# Altium schematic sheet ESP32-S3.SchDoc
size A3
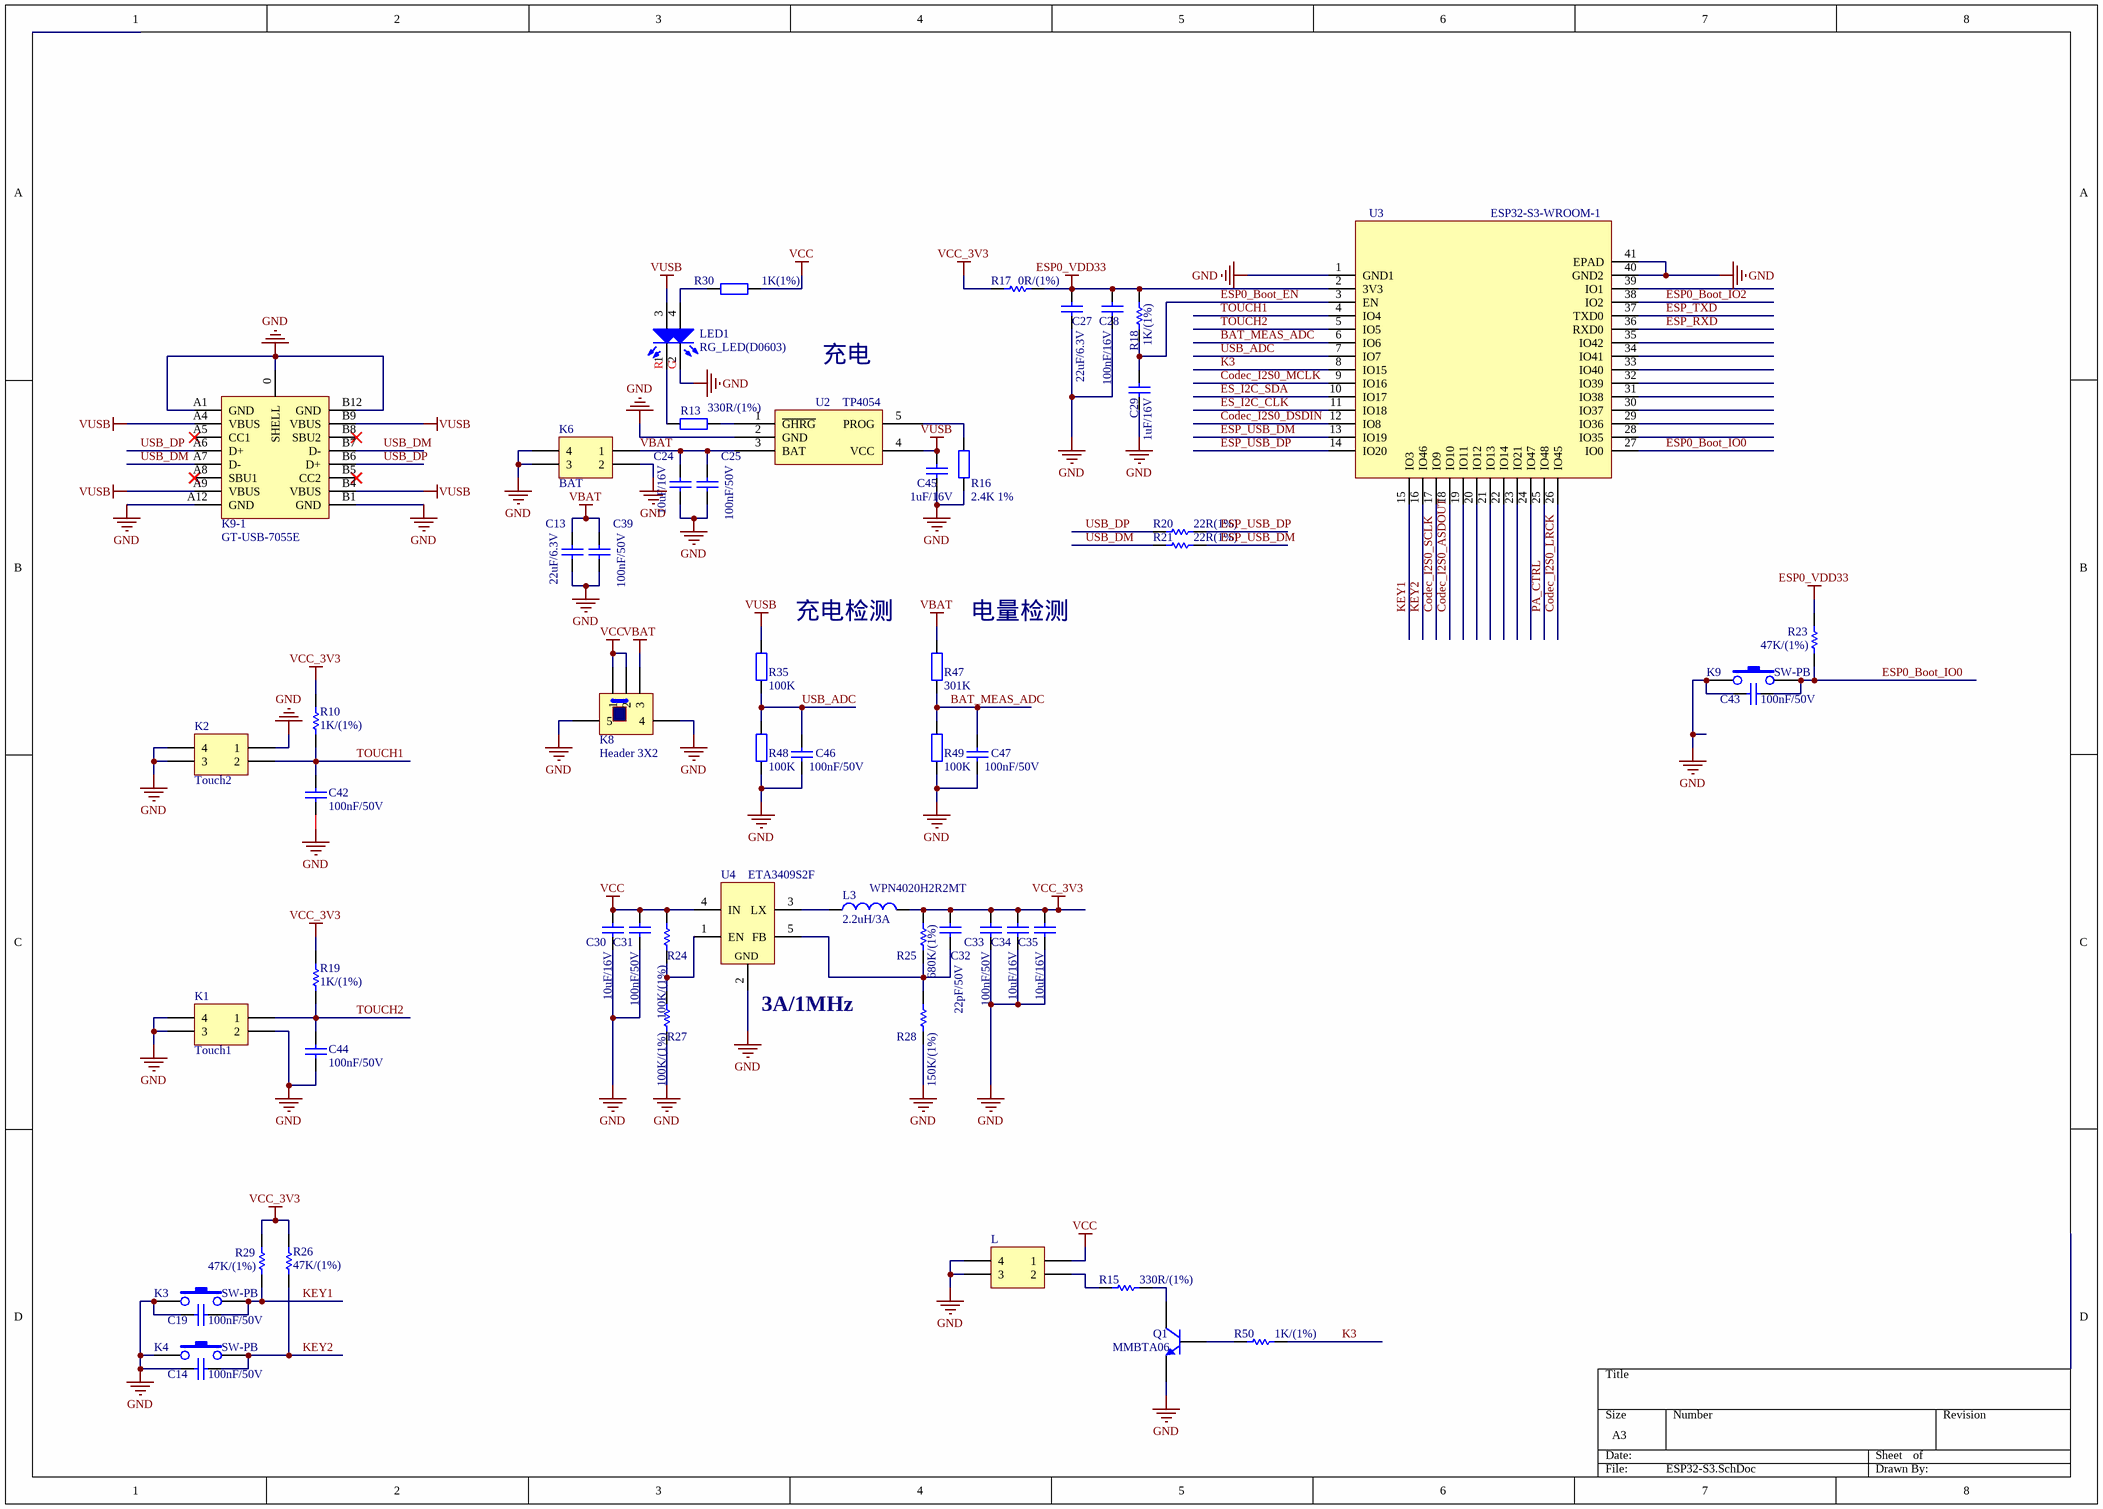
[diagram p0: ESP32-S3.SchDoc]

## Parts
C13  22uF/6.3V  [C0402]
C14  100nF/50V  [C0402]
C19  100nF/50V  [C0402]
C24  10uF/16V  [C0402]
C25  100nF/50V  [C0402]
C27  22uF/6.3V  [C0402]
C28  100nF/16V  [C0402]
C29  1uF/16V  [C0402]
C30  10uF/16V  [C0402]
C31  100nF/50V  [C0402]
C32  22pF/50V  [C0402]
C33  100nF/50V  [C0402]
C34  10uF/16V  [C0402]
C35  10uF/16V  [C0402]
C39  100nF/50V  [C0402]
C42  100nF/50V  [C0402]
C43  100nF/50V  [C0402]
C44  100nF/50V  [C0402]
C45  1uF/16V  [C0402]
C46  100nF/50V  [C0402]
C47  100nF/50V  [C0402]
K1  Touch1  [HC-1.25-2PWT]
K2  Touch2  [HC-1.25-2PWT]
K3  SW-PB  [K(3*4*2.5H)]
K4  SW-PB  [K(3*4*2.5H)]
K6  BAT  [HC-1.25-2PWT]
K8  Header 3X2  [SS12D07VG4 087]
K9  SW-PB  [K(3*4*2.5H)]
K9-1  GT-USB-7055E  [GT-USB-7055E]
L  (no value)  [HC-1.25-2PWT]
L3  2.2uH/3A  [SWPA4020]
LED1  RG_LED(D0603)  [LED-SMD_4P-L1.6]
Q1  MMBTA06  [SOT-23]
R10  1K/(1%)  [R0402]
R13  330R/(1%)  [R0402]
R15  330R/(1%)  [R0402]
R16  2.4K 1%  [R0402]
R17  0R/(1%)  [R0402]
R18  1K/(1%)  [R0402]
R19  1K/(1%)  [R0402]
R20  22R(1%)  [R0402]
R21  22R(1%)  [R0402]
R23  47K/(1%)  [R0402]
R24  100K/(1%)  [R0402]
R25  680K/(1%)  [R0402]
R26  47K/(1%)  [R0402]
R27  100K/(1%)  [R0402]
R28  150K/(1%)  [R0402]
R29  47K/(1%)  [R0402]
R30  1K(1%)  [R0402]
R35  100K  [R0402]
R47  301K  [R0402]
R48  100K  [R0402]
R49  100K  [R0402]
R50  1K/(1%)  [R0402]
U2  TP4054  [SOT-23-5]
U3  ESP32-S3-WROOM-1  [ESP32-S3-WROOM-1]
U4  ETA3409S2F  [SOT23-5_ETA3409S2F]

## Nets
ESP0_VDD33: C27.2 C28.2 R17.2 R18.1 R23.1 U3.2(3V3)
GND: C13.1 C14.2 C19.2 C24.1 C25.1 C27.1 C28.1 C29.1 C30.1 C31.1 C33.1 C34.1 C35.1 C39.1 C42.2 C43.2 C44.2 C45.2 C46.2 C47.2 K1.2 K1.3 K1.4 K2.1 K2.3 K2.4 K3.1 K4.2 K6.2 K6.3 K6.4 K8.4 K8.5 K9.1 K9-1.0(SHELL) K9-1.A1(GND) K9-1.A12(GND) K9-1.B1(GND) K9-1.B12(GND) L.3 L.4 LED1.2 Q1.2(E) R16.1 R27.2 R28.2 R48.1 R49.1 U2.2(GND) U3.1(GND1) U3.40(GND2) U3.41(EPAD) U4.2(GND)
VBAT: C13.2 C24.2 C25.2 C39.2 K6.1 K8.3 R47.2 U2.3(BAT)
VCC: C30.2 C31.2 K8.1 K8.2 L.1 R24.1 R30.2 U4.4(IN)
VCC_3V3: C32.2 C33.2 C34.2 C35.2 L3.2 R10.1 R17.1 R19.1 R25.1 R26.1 R29.1
VUSB: C45.1 K9-1.A4(VBUS) K9-1.A9(VBUS) K9-1.B4(VBUS) K9-1.B9(VBUS) LED1.3 R35.2 U2.4(VCC)
BAT_MEAS_ADC: C47.1 R47.1 R49.2 U3.6(IO6)
Codec_I2S0_ASDOUT: U3.18(IO10)
Codec_I2S0_DSDIN: U3.12(IO8)
Codec_I2S0_LRCK: U3.26(IO45)
Codec_I2S0_MCLK: U3.9(IO16)
Codec_I2S0_SCLK: U3.17(IO9)
ES_I2C_CLK: U3.11(IO18)
ES_I2C_SDA: U3.10(IO17)
ESP0_Boot_EN: C29.2 R18.2 U3.3(EN)
ESP0_Boot_IO0: C43.1 K9.2 R23.2 U3.27(IO0)
ESP0_Boot_IO2: U3.38(IO2)
ESP_RXD: U3.36(RXD0)
ESP_TXD: U3.37(TXD0)
ESP_USB_DM: R21.1 U3.13(IO19)
ESP_USB_DP: R20.1 U3.14(IO20)
K3: R50.1 U3.8(IO15)
KEY1: C19.1 K3.2 R29.2 U3.15(IO3)
KEY2: C14.1 K4.1 R26.2 U3.16(IO46)
PA_CTRL: U3.25(IO48)
TOUCH1: C42.1 K2.2 R10.2 U3.4(IO4)
TOUCH2: C44.1 K1.1 R19.2 U3.5(IO5)
USB_ADC: C46.1 R35.1 R48.2 U3.7(IO7)
USB_DM: K9-1.A7(D-) K9-1.B7(D-) R21.2
USB_DP: K9-1.A6(D+) K9-1.B6(D+) R20.2
NetC32_1: C32.1 R25.2 R28.1 U4.5(FB)
NetL3_1: L3.1 U4.3(LX)
NetL_2: L.2 R15.2
NetLED1_1: LED1.1 R13.1
NetLED1_4: LED1.4 R30.1
NetQ1_1: Q1.1(B) R50.2
NetQ1_3: Q1.3(C) R15.1
NetR13_2: R13.2 U2.1(~{GHRG})
NetR16_2: R16.2 U2.5(PROG)
NetR24_2: R24.2 R27.1 U4.1(EN)

Not connected (* = marked no-connect by the designer): K9-1 A5(CC1)* A8(SBU1)* B5(CC2)* B8(SBU2)*; U3 19(IO11) 20(IO12) 21(IO13) 22(IO14) 23(IO21) 24(IO47) 28(IO35) 29(IO36) 30(IO37) 31(IO38) 32(IO39) 33(IO40) 34(IO41) 35(IO42) 39(IO1)

## Notes on the sheet
- 充电
- (near R35) 充电检测
- (near R47) 电量检测
- (near L3) WPN4020H2R2MT
- (near U4) 3A/1MHz
- (in symbol RG_LED) R; G

## Library data of the parts
C13 C24 = 0603 10uF (106) 10% 10V: 贴片电容; ComponentLink1Description: *; ComponentLink1URL: *; Package: *; Supplier: *; SuppliersPartNumber: *
C14 C19 C27-C35 C42-C44 = Cap: Capacitor; Value: 100pF; Published: 8-Jun-2000; LatestRevisionDate: 17-Jul-2002; LatestRevisionNote: Re-released for DXP Platform.; PackageReference: RAD-0.3; Publisher: Altium Limited
C25 C39 = 0402 100nF (104) 10% 16V: 贴片电容; ComponentLink1Description: *; ComponentLink1URL: *; Package: *; Supplier: *; SuppliersPartNumber: *
C45 = 0603 470nF (474) 10% 25V: 贴片电容; ComponentLink1Description: *; ComponentLink1URL: *; Package: *; Supplier: *; SuppliersPartNumber: *
C46 C47 = 0603 1.0pF (010) 0.25pF 50V: 贴片电容; ComponentLink1Description: *; ComponentLink1URL: *; Package: *; Supplier: *; SuppliersPartNumber: *
K1 K2 K6 L = Header 2X2: Header, 2-Pin, Dual row; LatestRevisionDate: 17-Jul-2002; LatestRevisionNote: Re-released for DXP Platform.; Publisher: Altium Limited
K8 = Header 3X2: Header, 3-Pin, Dual row; LatestRevisionDate: 17-Jul-2002; LatestRevisionNote: Re-released for DXP Platform.; Publisher: Altium Limited
L3 = Inductor: Code_IEC: 1005; Value: 10mH; Published: 8-Jun-2000; LatestRevisionDate: 29-May-2009; LatestRevisionNote: IPC-7351 Footprint Added.; PackageReference: 0402-A; Publisher: Altium Limited; PackageDescription: Chip Inductor; Code_JEITA: 0402
LED1 = RG_LED
Q1 = 2N3904: NPN General Purpose Amplifier; WTPN: 730015R; Published: 8-Jun-2000; LatestRevisionDate: 15-Jan-2003; LatestRevisionNote: PCB Footprint 'BCY-W3/D4.7' replaced; DatasheetVersion: 1997; PackageVersion: Sep-1998; PackageReference: TO-92A; Publisher: Altium Limited; Code_JEDEC: TO-92A; ComponentLink1Description: Manufacturer Link; ComponentLink1URL: http://www.fairchildsemi.com/; ComponentLink2Description: Datasheet; ComponentLink2URL: http://www.fairchildsemi.com/ds/2N%2F2N3904.pdf; Value: MMBTA06
R10 R15 R17-R21 R23-R29 R50 = Res1: Resistor; Value: 1K; Published: 8-Jun-2000; LatestRevisionDate: 17-Jul-2002; LatestRevisionNote: Re-released for DXP Platform.; PackageReference: AXIAL-0.3; Publisher: Altium Limited
R13 R30 = 0402 1KΩ (1001) 1%: 贴片电阻; ComponentLink1Description: *; ComponentLink1URL: *; Package: *; Supplier: *; SuppliersPartNumber: *
R16 = 0402 2.4KΩ (2401) 1%: 贴片电阻; ComponentLink1Description: *; ComponentLink1URL: *; Package: *; Supplier: *; SuppliersPartNumber: *
R35 R47-R49 = 0402 100KΩ (1003) 1%: 贴片电阻; ComponentLink1Description: *; ComponentLink1URL: *; Package: *; Supplier: *; SuppliersPartNumber: *
U2 = TP4054: 电池电源管理; ComponentLink1Description: *; ComponentLink1URL: *; Package: *; Supplier: *; SuppliersPartNumber: *